# Altium schematic sheet DriverSPI.SchDoc
size A4
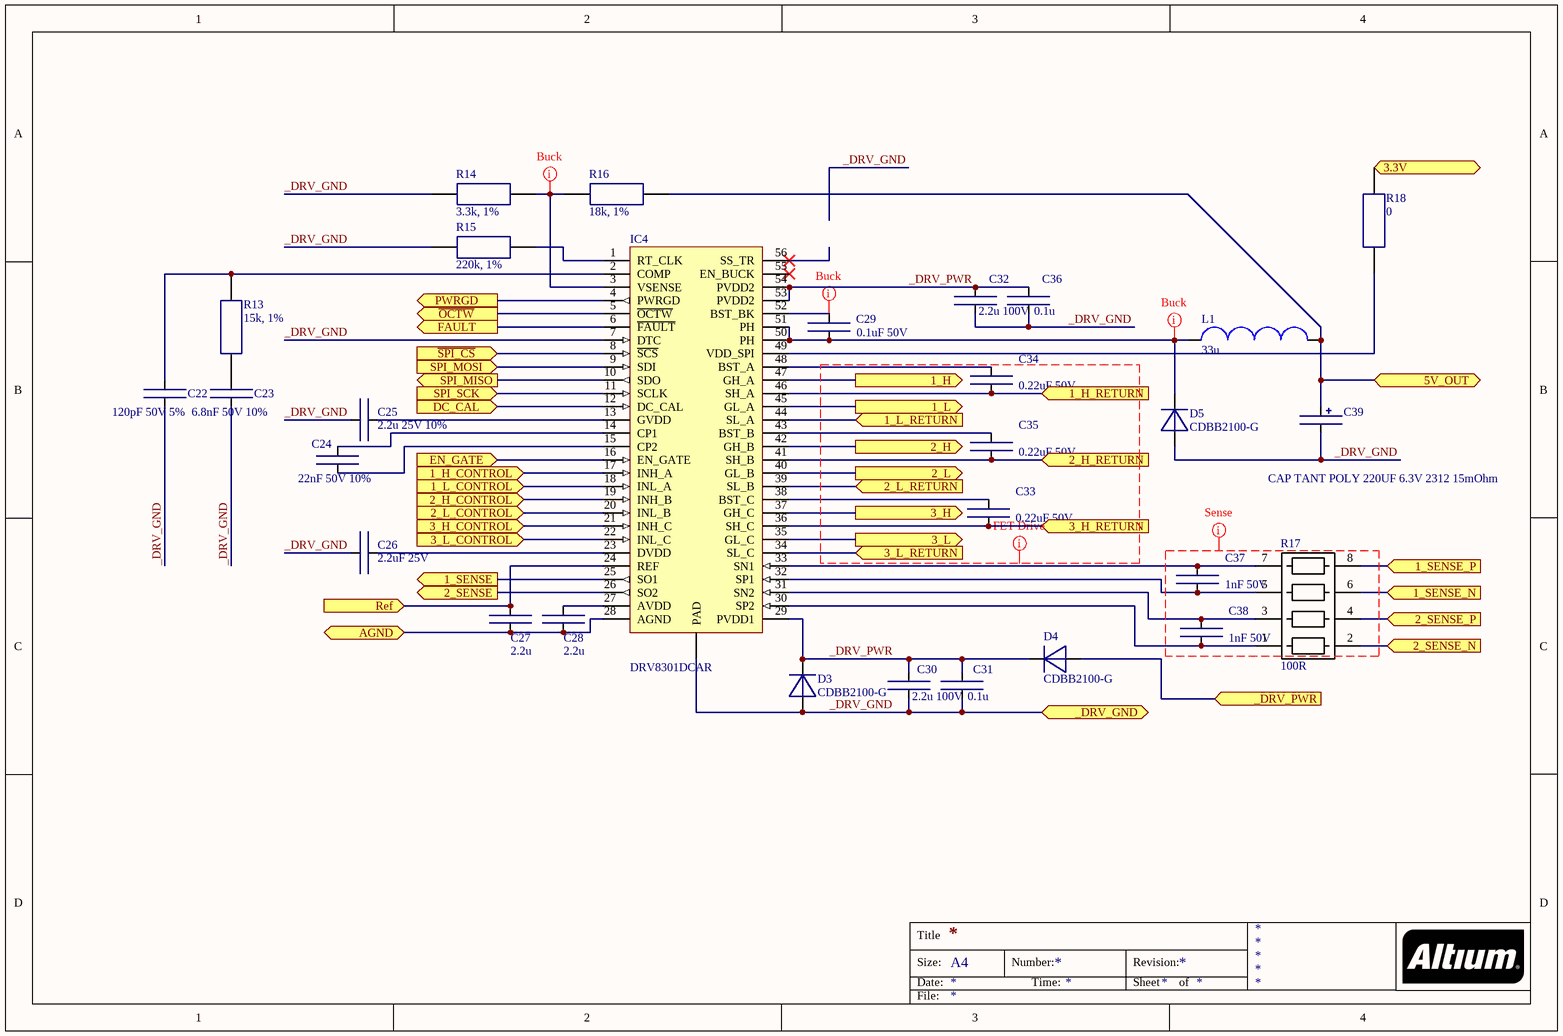
[diagram p0: DriverSPI.SchDoc]

## Parts
C22  120pF 50V 5%  [0402small]
C23  6.8nF 50V 10%  [0402small]
C24  22nF 50V 10%  [0402small]
C25  2.2u 25V 10%  [CAPC1608X08N(0603)]
C26  2.2uF 25V  [0603x]
C27  2.2u  [0603x]
C28  2.2u  [CAPC1608X08N(0603)]
C29  0.1uF 50V  [0402small]
C30  2.2u 100V  [EIA CC1210]
C31  0.1u  [C0805]
C32  2.2u 100V  [EIA CC1210]
C33  0.22uF 50V  [0402small]
C34  0.22uF 50V  [0402small]
C35  0.22uF 50V  [0402small]
C36  0.1u  [C0805]
C37  1nF 50V  [0402small]
C38  1nF 50V  [0402small]
C39  CAP TANT POLY 220UF 6.3V 2312 15mOhm  [C]
D3  CDBB2100-G  [SMB_real]
D4  CDBB2100-G  [SMB_real]
D5  CDBB2100-G  [SMB_real]
IC4  DRV8301DCAR  [HTSSOP56(L)]
L1  33u  [DR74]
R13  15k, 1%  [0402small]
R14  3.3k, 1%  [0402small]
R15  220k, 1%  [0402small]
R16  18k, 1%  [0402small]
R17  100R  [RES_ARRAY_4X]
R18  0  [1206x]

## Ports
1_H (out), 1_H_CONTROL (in), 1_H_RETURN (in), 1_L (out), 1_L_CONTROL (in), 1_L_RETURN (in), 1_SENSE (out), 1_SENSE_N (in), 1_SENSE_P (in), 2_H (out), 2_H_CONTROL (in), 2_H_RETURN (in), 2_L (out), 2_L_CONTROL (in), 2_L_RETURN (in), 2_SENSE (out), 2_SENSE_N (in), 2_SENSE_P (in), 3.3V (in), 3_H (out), 3_H_CONTROL (in), 3_H_RETURN (in), 3_L (out), 3_L_CONTROL (in), 3_L_RETURN (in), 5V_OUT, _DRV_GND (bidir), _DRV_PWR (in), AGND (bidir), DC_CAL (in), EN_GATE (in), FAULT (out), PWRGD (out), Ref (in), SPI_MISO (out), SPI_MOSI (in), SPI_SCK (in), ~{OCTW} (out), ~{SPI_CS} (in)

## Nets
1_H: IC4.47(GH_A) ; port 1_H
1_H_CONTROL: IC4.17(INH_A) ; port 1_H_CONTROL
1_H_RETURN: C34.1 IC4.46(SH_A) ; port 1_H_RETURN
1_L: IC4.45(GL_A) ; port 1_L
1_L_CONTROL: IC4.18(INL_A) ; port 1_L_CONTROL
1_L_RETURN: IC4.44(SL_A) ; port 1_L_RETURN
1_SENSE: IC4.25(SO1) ; port 1_SENSE
1_SENSE_N: R17.6 ; port 1_SENSE_N
1_SENSE_P: R17.8 ; port 1_SENSE_P
2_H: IC4.42(GH_B) ; port 2_H
2_H_CONTROL: IC4.19(INH_B) ; port 2_H_CONTROL
2_H_RETURN: C35.1 IC4.41(SH_B) ; port 2_H_RETURN
2_L: IC4.40(GL_B) ; port 2_L
2_L_CONTROL: IC4.20(INL_B) ; port 2_L_CONTROL
2_L_RETURN: IC4.39(SL_B) ; port 2_L_RETURN
2_SENSE: IC4.26(SO2) ; port 2_SENSE
2_SENSE_N: R17.2 ; port 2_SENSE_N
2_SENSE_P: R17.4 ; port 2_SENSE_P
3.3V: R18.1 ; port 3.3V
3_H: IC4.37(GH_C) ; port 3_H
3_H_CONTROL: IC4.21(INH_C) ; port 3_H_CONTROL
3_H_RETURN: C33.1 IC4.36(SH_C) ; port 3_H_RETURN
3_L: IC4.35(GL_C) ; port 3_L
3_L_CONTROL: IC4.22(INL_C) ; port 3_L_CONTROL
3_L_RETURN: IC4.34(SL_C) ; port 3_L_RETURN
5V_OUT: C39.1 L1.2 R16.1 ; port 5V_OUT
_DRV_GND: C22.1 C23.1 C25.1 C26.2 C30.2 C31.2 C32.2 C36.2 C39.2 D3.1 D5.1 IC4.7(DTC) IC4.57(PAD) R14.2 R15.2 ; port _DRV_GND
_DRV_PWR: C30.1 C31.1 C32.1 C36.1 D3.2 D4.2 IC4.29(PVDD1) IC4.53(PVDD2) IC4.54(PVDD2)
_DRV_PWR: D4.1 ; port _DRV_PWR  [a separate net that carries the same name]
AGND: C27.2 C28.2 IC4.28(AGND) ; port AGND
DC_CAL: IC4.12(DC_CAL) ; port DC_CAL
EN_GATE: IC4.16(EN_GATE) ; port EN_GATE
FAULT: IC4.6(~{FAULT}) ; port FAULT
~{OCTW}: IC4.5(~{OCTW}) ; port ~{OCTW}
PWRGD: IC4.4(PWRGD) ; port PWRGD
Ref: C27.1 IC4.24(REF) ; port Ref
~{SPI_CS}: IC4.8(~{SCS}) ; port ~{SPI_CS}
SPI_MISO: IC4.10(SDO) ; port SPI_MISO
SPI_MOSI: IC4.9(SDI) ; port SPI_MOSI
SPI_SCK: IC4.11(SCLK) ; port SPI_SCK
NetC22_2: C22.2 IC4.2(COMP) R13.2
NetC23_2: C23.2 R13.1
NetC24_1: C24.1 IC4.14(CP1)
NetC24_2: C24.2 IC4.15(CP2)
NetC25_2: C25.2 IC4.13(GVDD)
NetC26_1: C26.1 IC4.23(DVDD)
NetC28_1: C28.1 IC4.27(AVDD)
NetC29_1: C29.1 D5.2 IC4.50(PH) IC4.51(PH) L1.1
NetC29_2: C29.2 IC4.52(BST_BK)
NetC33_2: C33.2 IC4.38(BST_C)
NetC34_2: C34.2 IC4.48(BST_A)
NetC35_2: C35.2 IC4.43(BST_B)
NetC37_1: C37.1 IC4.32(SP1) R17.5
NetC37_2: C37.2 IC4.33(SN1) R17.7
NetC38_1: C38.1 IC4.30(SP2) R17.1
NetC38_2: C38.2 IC4.31(SN2) R17.3
NetIC4_1: IC4.1(RT_CLK) R15.1
NetIC4_3: IC4.3(VSENSE) R14.1 R16.2
NetIC4_49: IC4.49(VDD_SPI) R18.2

Not connected (* = marked no-connect by the designer): IC4 55(EN_BUCK)* 56(SS_TR)*

## Layout directives
net class Sense: (no net found under the mark)
net class FET Drive: (no net found under the mark)
net class Buck: NetC29_1, NetC29_2, NetIC4_3

## Notes on the sheet
- Title
- Size:
- Date:
- A4
- Number:
- Time:
- Revision:
- Sheet
- of
- File:

## Library data of the parts
C22 = Ceramic Chip Capacitor: Value: CAP CER 120PF 50V NP0 0402; Order Number: C0402C121J5GACTU; Distributor: Panasonic; Package: 0402
C23 = Ceramic Chip Capacitor: Value: CAP CER 6800PF 50V X7R 0402; Order Number: GRM155R71H682KA88D; Distributor: Murata; Package: 0402
C24 = Ceramic Chip Capacitor: Value: CAP CER 0.022UF 50V X7R 0402; Order Number: GRM155R71H223KA12D; Distributor: Murata Electronics; Package: 0402
C25-C28 = Ceramic Chip Capacitor: Value: CAP CER 2.2UF 25V X5R 0603; Order Number: GRM188R61E225KA12D; Distributor: Murata Electronics; Package: 0603
C29 = Ceramic Chip Capacitor: Value: CAP CER 0.1UF 50V X5R 0402; Order Number: C1005X5R1H104K050BB; Distributor: TDK Corporation; Package: 0402
C30 C32 = Ceramic Chip Capacitor: Value: CAP CER 2.2UF 100V X7R 1210; Order Number: C1210X225K1RACAUTO; Distributor: KEMET; Package: 1210
C31 C36 = Ceramic Chip Capacitor: Value: CAP CER 0.1UF 100V X7R 0805; Order Number: C0805C104K1RACTU; Distributor: KEMET; Package: 0805
C33-C35 = Ceramic Chip Capacitor: Value: CAP CER 0.22UF 50V X5R 0402; Order Number: UMK105BJ224KV-F; Distributor: Taiyo Yuden; Package: 0402
C37 C38 = Ceramic Chip Capacitor: Value: CAP CER 1000PF 50V C0G 0402; Order Number: CGA2B2C0G1H102J050BD; Distributor: TDK Corporation; Package: 0402
C39 = Tantalum Chip Capacitor: Order Number: T520C227M006ATE015; Value: CAP TANT POLY 220UF 6.3V 2312 15mOhm; Package: C; Distributor: KEMET
D3-D5 = ES1A...D: Value: SCHOTTKY 100V 2A DO214AA; Order Number: CDBB2100-G; Distributor: Comchip Technology; Package: SMB
IC4 = DRV8301: Value: DRV 8301 - IC MOTOR CONTROLLER SPI 56HTSSOP; Distributor: Texas Instruments; Order Number: DRV8301DCAR; Package: HTSSOP56
L1 = DR74: Value: FIXED IND 33UH 1.41A 143 MOHM; Order Number: DR74-330-R; Distributor: Eaton; Package: Nonstandard
R13 = SMD: Value: RES SMD 15K OHM 1% 1/10W 0402; Order Number: ERJ-2RKF1502X; Package: 0402; Distributor: Panasonic
R14 = SMD: Value: RES SMD 3.3K OHM 1% 1/10W 0402; Order Number: ERJ-2RKF3301X; Package: 0402; Distributor: Panasonic
R15 = SMD: Value: RES SMD 220K OHM 1% 1/10W 0402; Order Number: ERJ-2RKF2203X; Package: 0402; Distributor: Panasonic
R16 R18 = SMD: Value: RES SMD 18K OHM 1% 1/10W 0402; Order Number: ERJ-2RKF1802X; Package: 0402; Distributor: Panasonic
R17 = RES_Array_4x: 742C0431000FP; Order Number: EXB-38V101JV; Value: RES ARRAY 4 RES 100 OHM 1206; Distributor: Panasonic; Package: 1206 (3216 Metric)